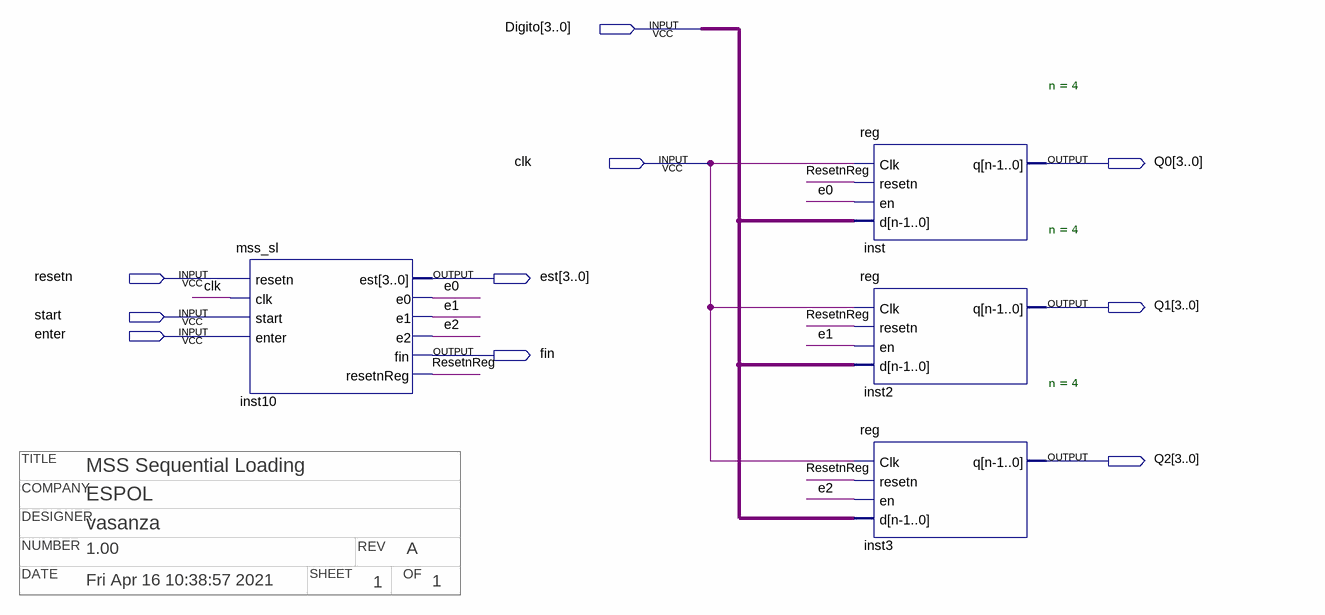
[diagram p0: schematic sheet]
// Quartus schematic Block1.bdf as structural Verilog: 4 symbols, 10 pins
// Title block: COMPANY: ESPOL; DATE: Fri Apr 16 10:38:57 2021; DESIGNER: vasanza; NUMBER: 1.00; OF: 1; REV: A; SHEET: 1; TITLE: MSS Sequential Loading
module Block1 (
  input  [3:0] Digito,
  input  clk,
  input  resetn,
  input  start,
  input  enter,
  output [3:0] Q0,
  output [3:0] est,
  output [3:0] Q1,
  output fin,
  output [3:0] Q2
);

  wire e0, e1, e2, ResetnReg;

  mss_sl inst10 (
    .resetn(resetn), .clk(clk), .start(start), .enter(enter), .est(est), .e0(e0), .e1(e1), .e2(e2),
    .fin(fin), .resetnReg(ResetnReg));
  \reg  #(.n(4)) inst (.Clk(clk), .resetn(ResetnReg), .en(e0), .d(Digito), .q(Q0));
  \reg  #(.n(4)) inst2 (.Clk(clk), .resetn(ResetnReg), .en(e1), .d(Digito), .q(Q1));
  \reg  #(.n(4)) inst3 (.Clk(clk), .resetn(ResetnReg), .en(e2), .d(Digito), .q(Q2));
endmodule
